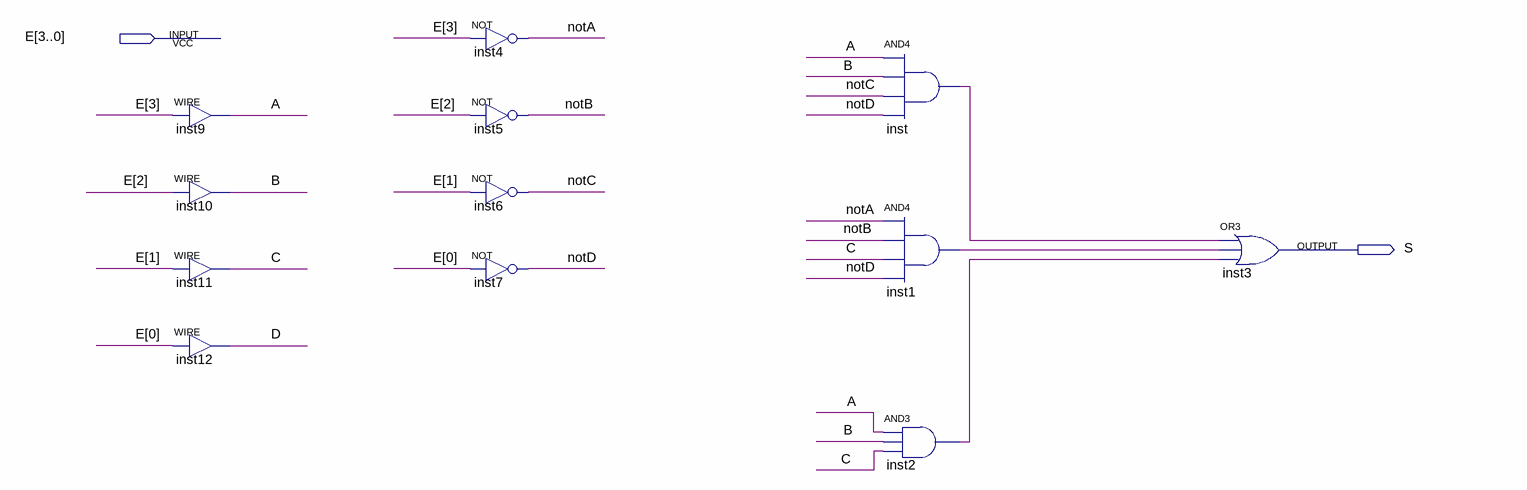
[diagram p0: schematic sheet]
// Quartus schematic segC.bdf as structural Verilog: 12 symbols, 2 pins
module segC (
  input  [3:0] E,
  output S
);

  wire A, B, C, D, inst1_out, inst2_out, inst_out, notA, notB, notC, notD;

  assign A = E[3];  // WIRE inst9
  assign B = E[2];  // WIRE inst10
  assign C = E[1];  // WIRE inst11
  assign D = E[0];  // WIRE inst12
  not inst4 (notA, E[3]);
  not inst5 (notB, E[2]);
  not inst6 (notC, E[1]);
  not inst7 (notD, E[0]);
  and inst (inst_out, A, B, notC, notD);
  and inst1 (inst1_out, notA, notB, C, notD);
  and inst2 (inst2_out, A, B, C);
  or inst3 (S, inst_out, inst1_out, inst2_out);
endmodule
